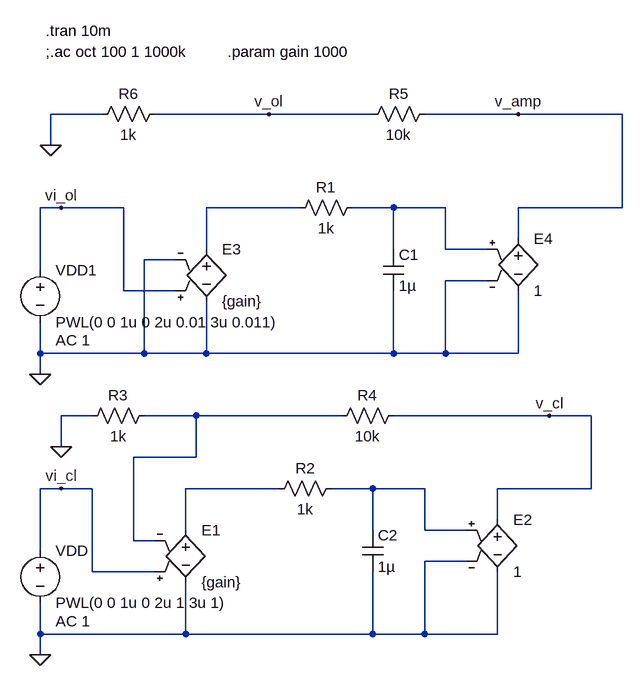
[diagram p0: schematic 1st_order_step.asc]
1st_order_step.asc, the LTspice schematic file:
Version 4
SHEET 1 1092 932
WIRE -928 -592 -1008 -592
WIRE -672 -592 -848 -592
WIRE -512 -592 -672 -592
WIRE -288 -592 -432 -592
WIRE -128 -592 -288 -592
WIRE -1008 -544 -1008 -592
WIRE -992 -448 -1024 -448
WIRE -896 -448 -992 -448
WIRE -624 -448 -768 -448
WIRE -480 -448 -544 -448
WIRE -400 -448 -480 -448
WIRE -128 -448 -128 -592
WIRE -128 -448 -288 -448
WIRE -288 -400 -288 -448
WIRE -768 -384 -768 -448
WIRE -480 -384 -480 -448
WIRE -400 -384 -400 -448
WIRE -336 -384 -400 -384
WIRE -816 -368 -864 -368
WIRE -1024 -352 -1024 -448
WIRE -336 -336 -400 -336
WIRE -896 -320 -896 -448
WIRE -816 -320 -896 -320
WIRE -1024 -224 -1024 -272
WIRE -864 -224 -864 -368
WIRE -864 -224 -1024 -224
WIRE -768 -224 -768 -304
WIRE -768 -224 -864 -224
WIRE -480 -224 -480 -320
WIRE -480 -224 -768 -224
WIRE -400 -224 -400 -336
WIRE -400 -224 -480 -224
WIRE -288 -224 -288 -320
WIRE -288 -224 -400 -224
WIRE -1024 -192 -1024 -224
WIRE -944 -128 -992 -128
WIRE -784 -128 -864 -128
WIRE -560 -128 -784 -128
WIRE -240 -128 -480 -128
WIRE -176 -128 -240 -128
WIRE -992 -80 -992 -128
WIRE -784 -64 -784 -128
WIRE -784 -64 -880 -64
WIRE -992 -16 -1024 -16
WIRE -944 -16 -992 -16
WIRE -656 -16 -800 -16
WIRE -512 -16 -576 -16
WIRE -432 -16 -512 -16
WIRE -176 -16 -176 -128
WIRE -176 -16 -320 -16
WIRE -320 32 -320 -16
WIRE -800 48 -800 -16
WIRE -512 48 -512 -16
WIRE -432 48 -432 -16
WIRE -368 48 -432 48
WIRE -880 64 -880 -64
WIRE -848 64 -880 64
WIRE -1024 80 -1024 -16
WIRE -368 96 -432 96
WIRE -944 112 -944 -16
WIRE -848 112 -944 112
WIRE -1024 208 -1024 160
WIRE -800 208 -800 128
WIRE -800 208 -1024 208
WIRE -512 208 -512 112
WIRE -512 208 -800 208
WIRE -432 208 -432 96
WIRE -432 208 -512 208
WIRE -320 208 -320 112
WIRE -320 208 -432 208
WIRE -1024 240 -1024 208
FLAG -1024 240 0
FLAG -992 -16 vi_cl
FLAG -1024 -192 0
FLAG -992 -448 vi_ol
FLAG -1008 -544 0
FLAG -672 -592 v_ol
FLAG -288 -592 v_amp
FLAG -240 -128 v_cl
FLAG -992 -80 0
SYMBOL voltage -1024 64 R0
WINDOW 123 24 124 Left 2
WINDOW 39 0 0 Left 2
SYMATTR Value2 AC 1
SYMATTR InstName VDD
SYMATTR Value PWL(0 0 1u 0 2u 1 3u 1)
SYMBOL res -528 -464 R90
WINDOW 0 0 56 VBottom 2
WINDOW 3 32 56 VTop 2
SYMATTR InstName R1
SYMATTR Value 1k
SYMBOL cap -496 -384 R0
SYMATTR InstName C1
SYMATTR Value 1µ
SYMBOL e2 -768 -400 R0
SYMATTR InstName E3
SYMATTR Value {gain}
SYMBOL e -288 -416 R0
SYMATTR InstName E4
SYMATTR Value 1
SYMBOL res -416 -608 R90
WINDOW 0 0 56 VBottom 2
WINDOW 3 32 56 VTop 2
SYMATTR InstName R5
SYMATTR Value 10k
SYMBOL res -832 -608 R90
WINDOW 0 0 56 VBottom 2
WINDOW 3 32 56 VTop 2
SYMATTR InstName R6
SYMATTR Value 1k
SYMBOL voltage -1024 -368 R0
WINDOW 123 24 124 Left 2
WINDOW 39 0 0 Left 2
SYMATTR Value2 AC 1
SYMATTR InstName VDD1
SYMATTR Value PWL(0 0 1u 0 2u 0.01 3u 0.011)
SYMBOL res -560 -32 R90
WINDOW 0 0 56 VBottom 2
WINDOW 3 32 56 VTop 2
SYMATTR InstName R2
SYMATTR Value 1k
SYMBOL cap -528 48 R0
SYMATTR InstName C2
SYMATTR Value 1µ
SYMBOL e2 -800 32 R0
SYMATTR InstName E1
SYMATTR Value {gain}
SYMBOL res -848 -144 R90
WINDOW 0 0 56 VBottom 2
WINDOW 3 32 56 VTop 2
SYMATTR InstName R3
SYMATTR Value 1k
SYMBOL res -464 -144 R90
WINDOW 0 0 56 VBottom 2
WINDOW 3 32 56 VTop 2
SYMATTR InstName R4
SYMATTR Value 10k
SYMBOL e -320 16 R0
SYMATTR InstName E2
SYMATTR Value 1
TEXT -1016 -688 Left 2 !;.ac oct 100 1 1000k
TEXT -736 -688 Left 2 !.param gain 1000
TEXT -1016 -720 Left 2 !.tran 10m

The netlist it stands for:
* 1st_order_step.asc
VDD vi_cl 0 PWL(0 0 1u 0 2u 1 3u 1) AC 1
R1 N002 N001 1k
C1 N002 0 1µ
E3 N001 0 vi_ol 0 {gain}
E4 v_amp 0 N002 0 1
R5 v_amp v_ol 10k
R6 v_ol 0 1k
VDD1 vi_ol 0 PWL(0 0 1u 0 2u 0.01 3u 0.011) AC 1
R2 N005 N004 1k
C2 N005 0 1µ
E1 N004 0 vi_cl N003 {gain}
R3 N003 0 1k
R4 v_cl N003 10k
E2 v_cl 0 N005 0 1
;.ac oct 100 1 1000k
.param gain 1000
.tran 10m
.backanno
.end

* Results of the author's LTspice run, read from the files saved beside the schematic
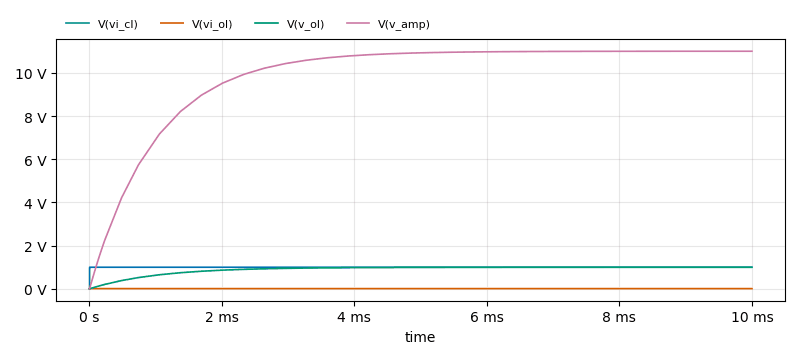
[diagram p1: Transient Analysis of 1st_order_step.asc, plotted from the saved traces]
* Transient Analysis, 1 run:
*   V(vi_cl): min 0 V, max 1 V, average 999.9 mV, rms 999.9 mV, last 1 V
*   V(vi_ol): min 0 V, max 11 mV, average 11 mV, rms 11 mV, last 11 mV
*   V(v_ol): min 0 V, max 1 V, average 899.3 mV, rms 921.7 mV, last 1 V
*   V(v_amp): min 0 V, max 11 V, average 9.892 V, rms 10.14 V, last 11 V